# Altium schematic sheet Motor Control.SchDoc
size A
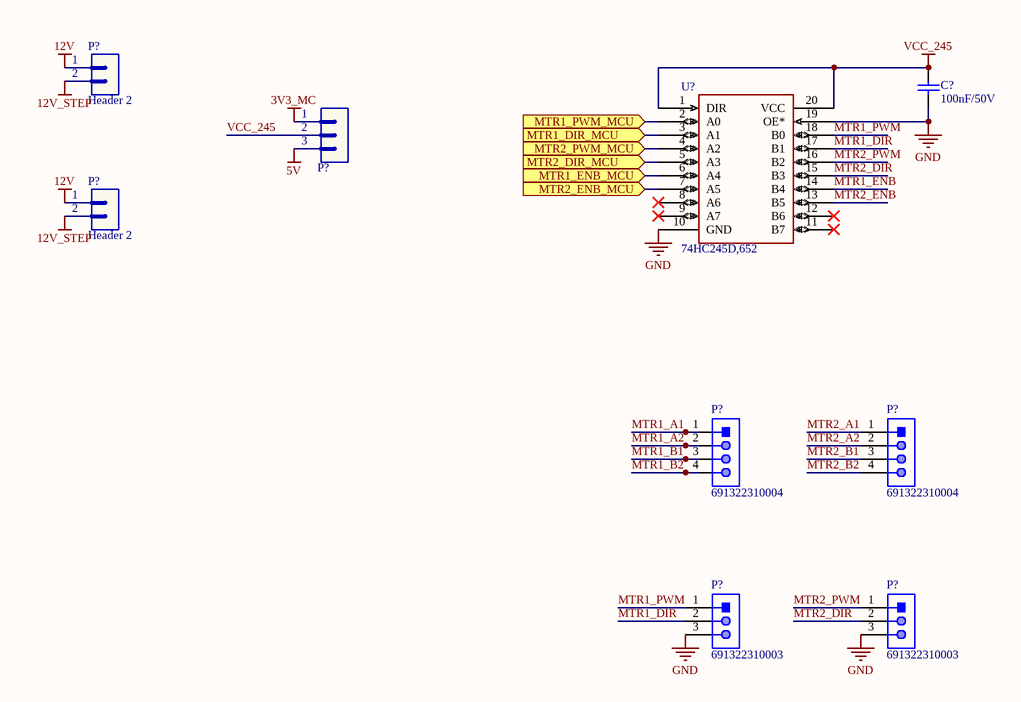
[diagram p0: Motor Control.SchDoc]

## Parts
(Parts that share a designator on the sheet are numbered #1, #2 ... from top to bottom, then left to right.)
C?  value 100nF/50V  [CAP-SM-0805]  (hidden comment: Cap-100nF-50V-0805)
P?#1  Header 2  [JP2]
P?#2  Header 3  [JP3]  (value not drawn)
P?#3  Header 2  [JP2]
P?#4  691322310004  [691322310004]
P?#5  691322310004  [691322310004]
P?#6  691322310003  [691322310003]
P?#7  691322310003  [691322310003]
U?  74HC245D,652  [SOT163-1_NEX]

## Ports
MTR1_DIR_MCU (in), MTR1_ENB_MCU (in), MTR1_PWM_MCU (in), MTR2_DIR_MCU (in), MTR2_ENB_MCU (in), MTR2_PWM_MCU (in)

## Nets
3V3_MC: P?#2.1
5V: P?#2.3
12V: P?#1.1 P?#3.1
12V_STEP: P?#1.2 P?#3.2
GND: C?.1 P?#6.3 P?#7.3 U?.10(GND) U?.19(OE*)
VCC_245: C?.2 P?#2.2 U?.1(DIR) U?.20(VCC)
MTR1_A1: P?#4.1
MTR1_A2: P?#4.2
MTR1_B1: P?#4.3
MTR1_B2: P?#4.4
MTR1_DIR: P?#6.2 U?.17(B1)
MTR1_DIR_MCU: U?.3(A1) ; port MTR1_DIR_MCU
MTR1_ENB: U?.14(B4)
MTR1_ENB_MCU: U?.6(A4) ; port MTR1_ENB_MCU
MTR1_PWM: P?#6.1 U?.18(B0)
MTR1_PWM_MCU: U?.2(A0) ; port MTR1_PWM_MCU
MTR2_A1: P?#5.1
MTR2_A2: P?#5.2
MTR2_B1: P?#5.3
MTR2_B2: P?#5.4
MTR2_DIR: P?#7.2 U?.15(B3)
MTR2_DIR_MCU: U?.5(A3) ; port MTR2_DIR_MCU
MTR2_ENB: U?.13(B5)
MTR2_ENB_MCU: U?.7(A5) ; port MTR2_ENB_MCU
MTR2_PWM: P?#7.1 U?.16(B2)
MTR2_PWM_MCU: U?.4(A2) ; port MTR2_PWM_MCU

Not connected (* = marked no-connect by the designer): U? 8(A6)* 9(A7)* 11(B7)* 12(B6)*

## Library data of the parts
C? = Cap-100nF-50V-0805: CAP CER 0.1UF 50V Y5V 0805; Manufacturer: Samsung Electro-Mechanics; Manufacturer Part Number: CL21F104ZBCNNNC; Local Supplier: thegioiic; Local Supplier Link: https://thegioiic.com/products/tu-100nf-0-1uf-50v-0805; Supplier 1: Digikey; Supplier 1 Part Number: 1276-1007-1-ND; Supplier 1 Link: https://www.digikey.com/product-detail/en/samsung-electro-mechanics/CL21F104ZBCNNNC/1276-1007-1-ND/3889093
P?#1 P?#3 = Header 2: Header, 2-Pin; LatestRevisionDate: 17-Jul-2002; LatestRevisionNote: Re-released for DXP Platform.; Publisher: Altium Limited
P?#2 = Header 3: Header, 3-Pin; LatestRevisionDate: 17-Jul-2002; LatestRevisionNote: Re-released for DXP Platform.; Publisher: Altium Limited
P?#4 P?#5 = 691322310004: WR-TBL Serie 322 Horizontal PCB Header, Pluggable, pitch 3.81mm, 4p; Compliance: RoHS; Modularity: No; Pin Number: 4; Rated Current [UL]: 10A; Working Voltage [UL]: 300VAC; ComponentLink1Description: Manufacturer; ComponentLink1URL: http://www.we-online.de; ComponentLink2URL: https://katalog.we-online.de/em/datasheet/691322310004.pdf; ComponentLink2Description: Datasheet; Mounting Technology: THT; Part Number: 691322310004; Packaging: Box; Operating Temperature: -40 to +105degC; PCB/Cable/Panel: PCB; Pitch: 3.81mm; Published Date: October 2019; Type: Horizontal; Publisher: Wurth Elektronik; Application: Pluggable
P?#6 P?#7 = 691322310003: WR-TBL Serie 322 Horizontal PCB Header, Pluggable, pitch 3.81mm, 3p; Compliance: RoHS; Modularity: No; Pin Number: 3; Rated Current [UL]: 10A; Working Voltage [UL]: 300VAC; ComponentLink1Description: Manufacturer; ComponentLink1URL: http://www.we-online.de; ComponentLink2URL: https://katalog.we-online.de/em/datasheet/691322310003.pdf; ComponentLink2Description: Datasheet; Mounting Technology: THT; Part Number: 691322310003; Packaging: Box; Operating Temperature: -40 to +105degC; PCB/Cable/Panel: PCB; Pitch: 3.81mm; Published Date: October 2019; Type: Horizontal; Publisher: Wurth Elektronik; Application: Pluggable